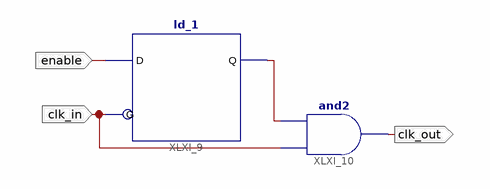
[diagram p0: schematic sheet 1]
// Xilinx ISE schematic clk_gate1.sch (spartan3e) as structural Verilog: 2 symbols, 3 ports
module clk_gate1 (
  input  clk_in,
  input  enable,
  output clk_out
);

  wire XLXN_1;

  ld_1 XLXI_9 (.D(enable), .G(clk_in), .Q(XLXN_1));
  and XLXI_10 (clk_out, clk_in, XLXN_1);
endmodule
